# EAGLE schematic 64ch_hirose_flex (EAGLE 7.2.0)
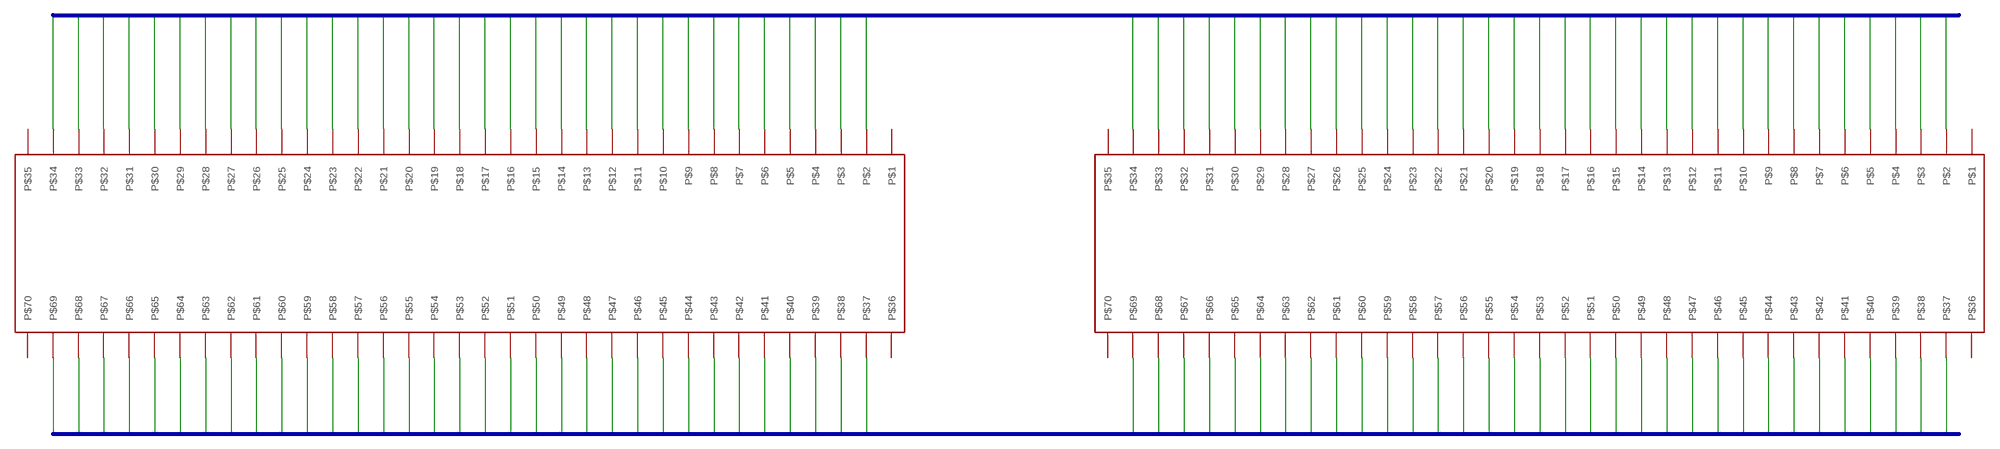
[diagram p0: schematic, sheet 1]

## Parts
U$1  HIROSE_DF40_70PIN  [HIROSE_DF40C-70DS]
U$2  HIROSE_DF40_70PIN  [HIROSE_DF40C-70DS]

## Nets
B0: U$1.P$34 U$2.P$34
B1: U$1.P$33 U$2.P$33
B2: U$1.P$32 U$2.P$32
B3: U$1.P$31 U$2.P$31
B4: U$1.P$30 U$2.P$30
B5: U$1.P$29 U$2.P$29
B6: U$1.P$28 U$2.P$28
B7: U$1.P$27 U$2.P$27
B8: U$1.P$26 U$2.P$26
B9: U$1.P$25 U$2.P$25
B10: U$1.P$24 U$2.P$24
B11: U$1.P$23 U$2.P$23
B12: U$1.P$22 U$2.P$22
B13: U$1.P$21 U$2.P$21
B14: U$1.P$20 U$2.P$20
B15: U$1.P$19 U$2.P$19
B16: U$1.P$18 U$2.P$18
B17: U$1.P$17 U$2.P$17
B18: U$1.P$16 U$2.P$16
B19: U$1.P$15 U$2.P$15
B20: U$1.P$14 U$2.P$14
B21: U$1.P$13 U$2.P$13
B22: U$1.P$12 U$2.P$12
B23: U$1.P$11 U$2.P$11
B24: U$1.P$10 U$2.P$10
B25: U$1.P$9 U$2.P$9
B26: U$1.P$8 U$2.P$8
B27: U$1.P$7 U$2.P$7
B28: U$1.P$6 U$2.P$6
B29: U$1.P$5 U$2.P$5
B30: U$1.P$4 U$2.P$4
B31: U$1.P$3 U$2.P$3
B32: U$1.P$2 U$2.P$2
C0: U$1.P$69 U$2.P$69
C1: U$1.P$68 U$2.P$68
C2: U$1.P$67 U$2.P$67
C3: U$1.P$66 U$2.P$66
C4: U$1.P$65 U$2.P$65
C5: U$1.P$64 U$2.P$64
C6: U$1.P$63 U$2.P$63
C7: U$1.P$62 U$2.P$62
C8: U$1.P$61 U$2.P$61
C9: U$1.P$60 U$2.P$60
C10: U$1.P$59 U$2.P$59
C11: U$1.P$58 U$2.P$58
C12: U$1.P$57 U$2.P$57
C13: U$1.P$56 U$2.P$56
C14: U$1.P$55 U$2.P$55
C15: U$1.P$54 U$2.P$54
C16: U$1.P$53 U$2.P$53
C17: U$1.P$52 U$2.P$52
C18: U$1.P$51 U$2.P$51
C19: U$1.P$50 U$2.P$50
C20: U$1.P$49 U$2.P$49
C21: U$1.P$48 U$2.P$48
C22: U$1.P$47 U$2.P$47
C23: U$1.P$46 U$2.P$46
C24: U$1.P$45 U$2.P$45
C25: U$1.P$44 U$2.P$44
C26: U$1.P$43 U$2.P$43
C27: U$1.P$42 U$2.P$42
C28: U$1.P$41 U$2.P$41
C29: U$1.P$40 U$2.P$40
C30: U$1.P$39 U$2.P$39
C31: U$1.P$38 U$2.P$38
C32: U$1.P$37 U$2.P$37
Unconnected: U$1.P$1 U$1.P$35 U$1.P$36 U$1.P$70 U$2.P$1 U$2.P$35 U$2.P$36 U$2.P$70

## Buses
B[0..32]
C[0..32]

## Library data of the parts
U$1 U$2 = GG_hirose70:HIROSE_DF40_70PIN